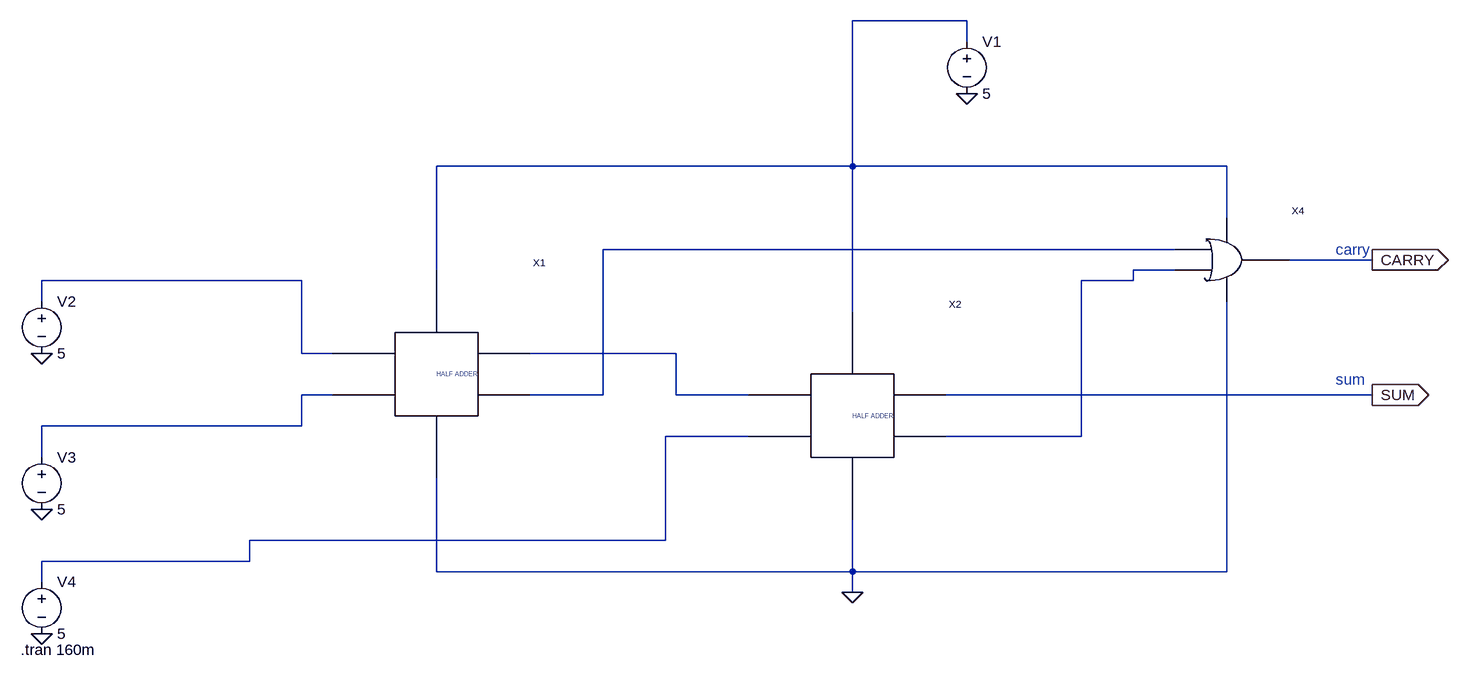
[diagram p0: schematic originalfulladder2imply.asc]
originalfulladder2imply.asc, the LTspice schematic file:
Version 4
SHEET 1 1548 680
WIRE 784 -432 608 -432
WIRE 784 -400 784 -432
WIRE 608 -208 608 -432
WIRE 608 -208 -32 -208
WIRE 1184 -208 608 -208
WIRE 1184 -128 1184 -208
WIRE 1104 -80 224 -80
WIRE 1408 -64 1280 -64
WIRE -32 -48 -32 -208
WIRE 1104 -48 1040 -48
WIRE -240 -32 -640 -32
WIRE 1040 -32 1040 -48
WIRE 1040 -32 960 -32
WIRE -640 0 -640 -32
WIRE 608 16 608 -208
WIRE -240 80 -240 -32
WIRE -192 80 -240 80
WIRE 336 80 112 80
WIRE -192 144 -240 144
WIRE 224 144 224 -80
WIRE 224 144 112 144
WIRE 336 144 336 80
WIRE 448 144 336 144
WIRE 1408 144 752 144
WIRE -240 192 -240 144
WIRE -240 192 -640 192
WIRE 448 208 320 208
WIRE 960 208 960 -32
WIRE 960 208 752 208
WIRE -640 240 -640 192
WIRE 320 368 320 208
WIRE 320 368 -320 368
WIRE -320 400 -320 368
WIRE -320 400 -640 400
WIRE -32 416 -32 272
WIRE 608 416 608 336
WIRE 608 416 -32 416
WIRE 1184 416 1184 0
WIRE 1184 416 608 416
WIRE -640 432 -640 400
WIRE 608 448 608 416
FLAG 1408 144 SUM
IOPIN 1408 144 Out
FLAG 1408 -64 CARRY
IOPIN 1408 -64 Out
FLAG 784 -320 0
FLAG -640 80 0
FLAG -640 320 0
FLAG -640 512 0
FLAG 608 448 0
SYMBOL halfadderimply -48 112 R0
SYMATTR InstName X1
SYMBOL halfadderimply 592 176 R0
SYMATTR InstName X2
SYMBOL orgateimply 1104 -48 R0
SYMATTR InstName X4
SYMBOL voltage 784 -416 R0
WINDOW 123 0 0 Left 0
WINDOW 39 0 0 Left 0
SYMATTR InstName V1
SYMATTR Value 5
SYMBOL voltage -640 -16 R0
WINDOW 123 0 0 Left 0
WINDOW 39 0 0 Left 0
SYMATTR InstName V2
SYMATTR Value 5
SYMBOL voltage -640 224 R0
WINDOW 123 0 0 Left 0
WINDOW 39 0 0 Left 0
SYMATTR InstName V3
SYMATTR Value 5
SYMBOL voltage -640 416 R0
WINDOW 123 0 0 Left 0
WINDOW 39 0 0 Left 0
SYMATTR InstName V4
SYMATTR Value 5
TEXT 1352 -80 Left 2 ;carry
TEXT 1352 120 Left 2 ;sum
TEXT -672 536 Left 2 !.tran 160m

The netlist it stands for:
* originalfulladder2imply.asc
XX1 N004 N006 N001 0 N005 N002 halfadderimply  ; pins A B VDD VSS SUM COUT
XX2 N005 N007 N001 0 SUM N003 halfadderimply  ; pins A B VDD VSS SUM COUT
XX4 N001 N002 N003 0 CARRY orgateimply  ; pins VDD A B VSS OUT
V1 N001 0 5
V2 N004 0 5
V3 N006 0 5
V4 N007 0 5
* carry
* sum
.tran 160m
.backanno
.end